# Altium schematic sheet CPU.SchDoc
size A3; DocumentNumber: 11; SheetNumber: 11; SheetTotal: 30
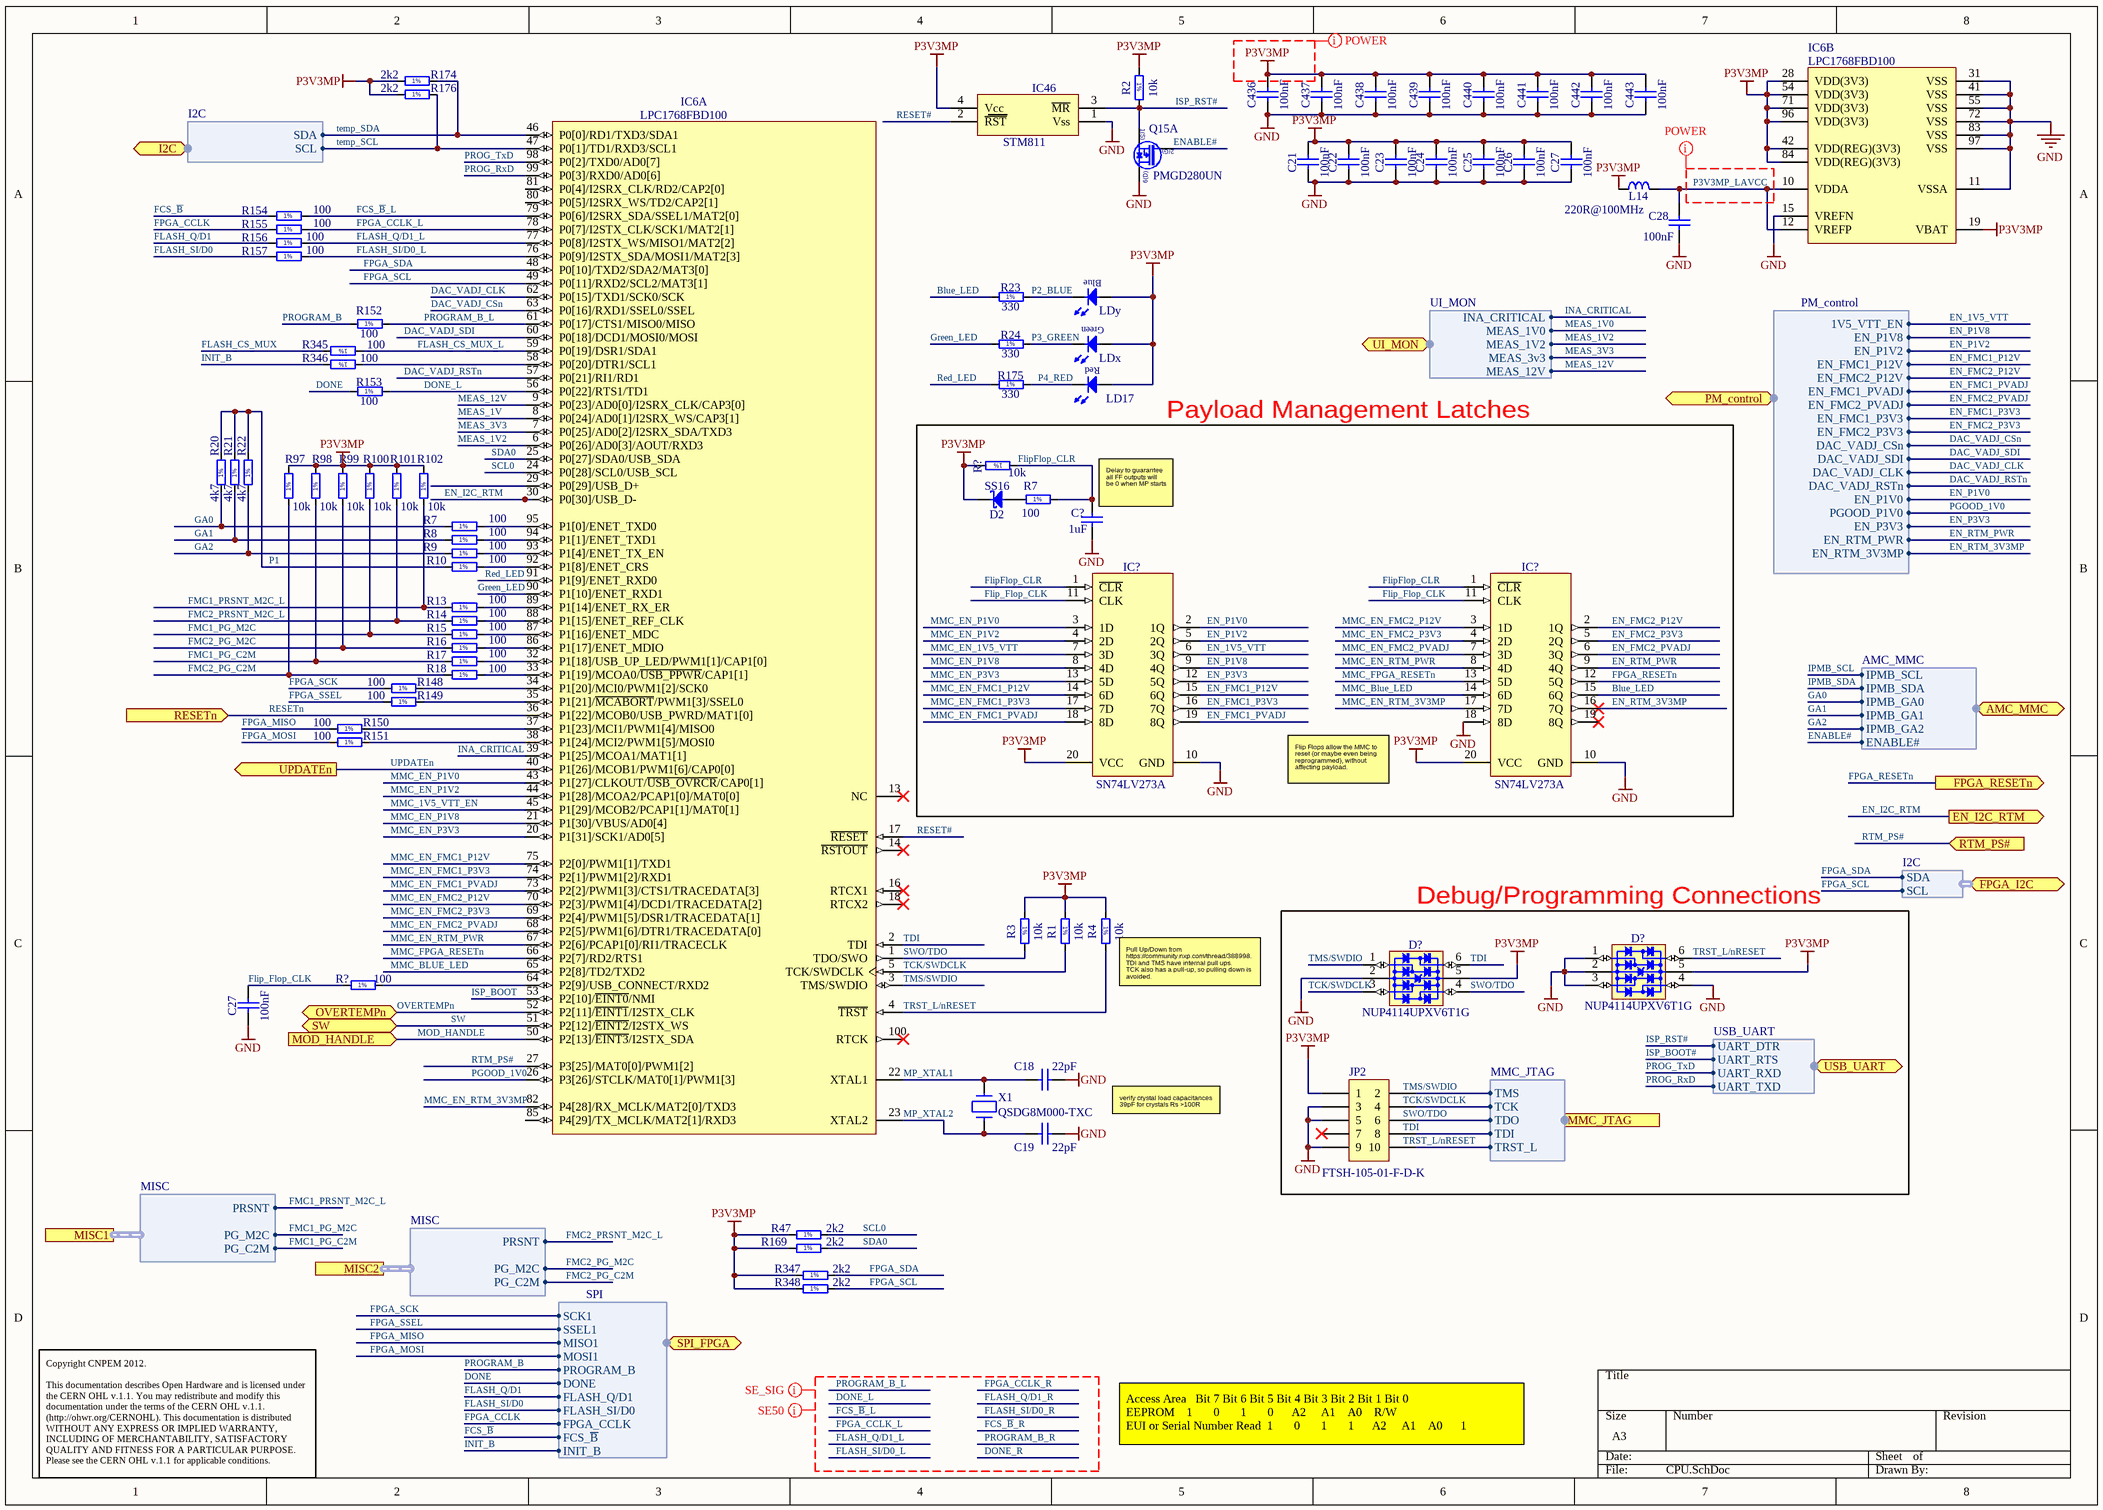
[diagram p0: CPU.SchDoc]

## Parts
(Parts that share a designator on the sheet are numbered #1, #2 ... from top to bottom, then left to right.)
C18  22pF  [CAPC1005X55N]
C19  22pF  [CAPC1005X55N]
C21  100nF  [CAPC0603X33N]
C22  100nF  [CAPC0603X33N]
C23  100nF  [CAPC0603X33N]
C24  100nF  [CAPC0603X33N]
C25  100nF  [CAPC0603X33N]
C26  100nF  [CAPC0603X33N]
C27#1  100nF  [CAPC0603X33N]
C27#2  100nF  [CAPC0603X33N]
C28  100nF  [CAPC0603X33N]
C436  100nF  [CAPC0603X33N]
C437  100nF  [CAPC0603X33N]
C438  100nF  [CAPC0603X33N]
C439  100nF  [CAPC0603X33N]
C440  100nF  [CAPC0603X33N]
C441  100nF  [CAPC0603X33N]
C442  100nF  [CAPC0603X33N]
C443  100nF  [CAPC0603X33N]
C?  1uF  [CAPC1608X87N]
D2  SS16  [DIOM5127X229N]
D?#1  NUP4114UPXV6T1G  [SOTFL50P160X60-6N]
D?#2  NUP4114UPXV6T1G  [SOTFL50P160X60-6N]
IC6  LPC1768FBD100  [QFP50P1600X1600X160-100N]  (parts A,B of 2)
IC46  STM811
IC?#1  SN74LV273A  [SOIC127P600X175-16N]
IC?#2  SN74LV273A  [SOIC127P600X175-16N]
JP2  FTSH-105-01-F-D-K  [CON_2x5_MINI]
L14  220R@100MHz  [INDC2012X105N]
LD17  Red  [LED_AVAGO_HSMC-C150]  (value not drawn)
LDx  Green  [LED_AVAGO_HSME-C120rev]  (value not drawn)
LDy  Blue  [LED_AVAGO_HSME-C120rev]  (value not drawn)
Q15  PMGD280UN  [SOT65P210X110-6N]  (part A of 2)
R1  10k  [RESC1005X40N]
R2  10k  [RESC1005X40N]
R3  10k  [RESC1005X40N]
R4  10k  [RESC1005X40N]
R7#1  100  [RESC1005X40N]
R7#2  100  [RESC1005X40N]
R8  100  [RESC1005X40N]
R9  100  [RESC1005X40N]
R10  100  [RESC1005X40N]
R13  100  [RESC1005X40N]
R14  100  [RESC1005X40N]
R15  100  [RESC1005X40N]
R16  100  [RESC1005X40N]
R17  100  [RESC1005X40N]
R18  100  [RESC1005X40N]
R20  4k7  [RESC1005X40N]
R21  4k7  [RESC1005X40N]
R22  4k7  [RESC1005X40N]
R23  330  [RESC1005X40N]
R24  330  [RESC1005X40N]
R47  2k2  [RESC1005X40N]
R97  10k  [RESC1005X40N]
R98  10k  [RESC1005X40N]
R99  10k  [RESC1005X40N]
R100  10k  [RESC1005X40N]
R101  10k  [RESC1005X40N]
R102  10k  [RESC1005X40N]
R148  100  [RESC1005X40N]
R149  100  [RESC1005X40N]
R150  100  [RESC1005X40N]
R151  100  [RESC1005X40N]
R152  100  [RESC1005X40N]
R153  100  [RESC1005X40N]
R154  100  [RESC1005X40N]
R155  100  [RESC1005X40N]
R156  100  [RESC1005X40N]
R157  100  [RESC1005X40N]
R169  2k2  [RESC1005X40N]
R174  2k2  [RESC1005X40N]
R175  330  [RESC1005X40N]
R176  2k2  [RESC1005X40N]
R345  100  [RESC1005X40N]
R346  100  [RESC1005X40N]
R347  2k2  [RESC1005X40N]
R348  2k2  [RESC1005X40N]
R?#1  10k  [RESC1005X40N]
R?#2  100  [RESC1005X40N]
X1  QSDG8M000-TXC  [XTAL_5.0*3.2]

## Blocks framed on the sheet
Payload Management Latches: C? D2 IC?#1 IC?#2 R7#1 R?#1
Debug/Programming Connections: D?#1 D?#2 JP2

## Ports
AMC_MMC (harness AMC_MMC), EN_I2C_RTM (out), FPGA_I2C (harness I2C), FPGA_RESETn (out), I2C (harness I2C), MISC1 (harness MISC), MISC2 (harness MISC), MMC_JTAG (harness MMC_JTAG), MOD_HANDLE (in), OVERTEMPn (bidir), PM_control (harness PM_control), RESETn (in), RTM_PS# (in), SPI_FPGA (harness SPI), SW, UI_MON (harness UI_MON), UPDATEn (out), USB_UART (harness USB_UART)

## Harnesses
SPI: SCK1, SSEL1, MISO1, MOSI1, FLASH_Q/D1, FLASH_SI/D0, PROGRAM_B, DONE, FPGA_CCLK, FCS_~{B}, INIT_B
MISC: PRSNT, PG_M2C, PG_C2M
I2C: SCL, SDA
MMC_JTAG: TCK, TDI, TDO, TMS, TRST_L
AMC_MMC: IPMB_SCL, IPMB_SDA, IPMB_GA0, IPMB_GA1, IPMB_GA2, ENABLE#
USB_UART: UART_DTR, UART_RTS, UART_RXD, UART_TXD
UI_MON: INA_CRITICAL, MEAS_1V0, MEAS_12V, MEAS_1V2, MEAS_3v3
PM_control: EN_P1V8, EN_P1V2, EN_FMC1_P12V, EN_FMC2_P12V, EN_FMC1_PVADJ, EN_FMC2_PVADJ, EN_FMC1_P3V3, EN_FMC2_P3V3, DAC_VADJ_CSn, DAC_VADJ_SDI, DAC_VADJ_CLK, DAC_VADJ_RSTn, 1V5_VTT_EN, EN_P1V0, PGOOD_P1V0, EN_P3V3, EN_RTM_PWR, EN_RTM_3V3MP

## Nets
GND: C18.1 C19.1 C21.1 C22.1 C23.1 C24.1 C25.1 C26.1 C27#1.1 C27#2.1 C28.1 C436.1 C437.1 C438.1 C439.1 C440.1 C441.1 C442.1 C443.1 C?.2 D?#1.1(I/O1) D?#1.2(GND) D?#1.3(I/O2) D?#1.4(I/O3) D?#2.2(GND) IC6.11(VSSA) IC6.15(VREFN) IC6.31(VSS) IC6.41(VSS) IC6.55(VSS) IC6.72(VSS) IC6.83(VSS) IC6.97(VSS) IC46.1(Vss) IC?#1.10(GND) IC?#2.10(GND) IC?#2.18(8D) JP2.3 JP2.5 JP2.9 Q15.6(D)
P3V3MP: C21.2 C22.2 C23.2 C24.2 C25.2 C26.2 C27#1.2 C436.2 C437.2 C438.2 C439.2 C440.2 C441.2 C442.2 C443.2 D2.1(C) D?#1.5(VBUS) D?#2.5(VBUS) IC6.19(VBAT) IC6.28(VDD(3V3)) IC6.42(VDD(REG)(3V3)) IC6.54(VDD(3V3)) IC6.71(VDD(3V3)) IC6.84(VDD(REG)(3V3)) IC6.96(VDD(3V3)) IC46.4(Vcc) IC?#1.20(VCC) IC?#2.20(VCC) JP2.1 L14.1 LD17.2(A) LDx.1(A) LDy.1(A) R1.1 R2.1 R3.1 R4.1 R47.1 R97.2 R98.2 R99.2 R100.2 R101.2 R102.2 R169.1 R174.1 R176.1 R347.1 R348.1 R?#1.2
Blue_LED: IC?#2.15(6Q) R23.1
DAC_VADJ_CLK: IC6.62(P0[15]/TXD1/SCK0/SCK) ; port PM_control.DAC_VADJ_CLK
DAC_VADJ_CSn: IC6.63(P0[16]/RXD1/SSEL0/SSEL) ; port PM_control.DAC_VADJ_CSn
DAC_VADJ_RSTn: IC6.57(P0[21]/RI1/RD1) ; port PM_control.DAC_VADJ_RSTn
DAC_VADJ_SDI: IC6.60(P0[18]/DCD1/MOSI0/MOSI) ; port PM_control.DAC_VADJ_SDI
DONE: R153.2 ; port SPI_FPGA.DONE
DONE_L: IC6.56(P0[22]/RTS1/TD1) R153.1
EN_1V5_VTT: IC?#1.6(3Q) ; port PM_control.1V5_VTT_EN
EN_FMC1_P3V3: IC?#1.16(7Q) ; port PM_control.EN_FMC1_P3V3
EN_FMC1_P12V: IC?#1.15(6Q) ; port PM_control.EN_FMC1_P12V
EN_FMC1_PVADJ: IC?#1.19(8Q) ; port PM_control.EN_FMC1_PVADJ
EN_FMC2_P3V3: IC?#2.5(2Q) ; port PM_control.EN_FMC2_P3V3
EN_FMC2_P12V: IC?#2.2(1Q) ; port PM_control.EN_FMC2_P12V
EN_FMC2_PVADJ: IC?#2.6(3Q) ; port PM_control.EN_FMC2_PVADJ
EN_I2C_RTM: IC6.30(P0[30]/USB_D-) ; port EN_I2C_RTM
EN_P1V0: IC?#1.2(1Q) ; port PM_control.EN_P1V0
EN_P1V2: IC?#1.5(2Q) ; port PM_control.EN_P1V2
EN_P1V8: IC?#1.9(4Q) ; port PM_control.EN_P1V8
EN_P3V3: IC?#1.12(5Q) ; port PM_control.EN_P3V3
EN_RTM_3V3MP: IC?#2.16(7Q) ; port PM_control.EN_RTM_3V3MP
EN_RTM_PWR: IC?#2.9(4Q) ; port PM_control.EN_RTM_PWR
ENABLE#: Q15.2(G) ; port AMC_MMC.ENABLE#
FCS_~{B}: R154.1 ; port SPI_FPGA.FCS_~{B}
FCS_~{B}_L: IC6.79(P0[6]/I2SRX_SDA/SSEL1/MAT2[0]) R154.2
FLASH_CS_MUX: R345.1
FLASH_CS_MUX_L: IC6.59(P0[19]/DSR1/SDA1) R345.2
FLASH_Q/D1: R156.1 ; port SPI_FPGA.FLASH_Q/D1
FLASH_Q/D1_L: IC6.77(P0[8]/I2STX_WS/MISO1/MAT2[2]) R156.2
FLASH_SI/D0: R157.1 ; port SPI_FPGA.FLASH_SI/D0
FLASH_SI/D0_L: IC6.76(P0[9]/I2STX_SDA/MOSI1/MAT2[3]) R157.2
Flip_Flop_CLK: C27#2.2 IC?#1.11(CLK) IC?#2.11(CLK) R?#2.2
FlipFlop_CLR: C?.1 IC?#1.1(~{CLR}) IC?#2.1(~{CLR}) R7#1.2 R?#1.1
FMC1_PG_C2M: R17.1 R98.1 ; port MISC1.PG_C2M
FMC1_PG_M2C: R15.1 R100.1 ; port MISC1.PG_M2C
FMC1_PRSNT_M2C_L: R13.1 R102.1 ; port MISC1.PRSNT
FMC2_PG_C2M: R18.1 R97.1 ; port MISC2.PG_C2M
FMC2_PG_M2C: R16.1 R99.1 ; port MISC2.PG_M2C
FMC2_PRSNT_M2C_L: R14.1 R101.1 ; port MISC2.PRSNT
FPGA_CCLK: R155.1 ; port SPI_FPGA.FPGA_CCLK
FPGA_CCLK_L: IC6.78(P0[7]/I2STX_CLK/SCK1/MAT2[1]) R155.2
FPGA_MISO: R150.2 ; port SPI_FPGA.MISO1
FPGA_MOSI: R151.2 ; port SPI_FPGA.MOSI1
FPGA_RESETn: IC?#2.12(5Q) ; port FPGA_RESETn
FPGA_SCK: R148.2 ; port SPI_FPGA.SCK1
FPGA_SCL: IC6.49(P0[11]/RXD2/SCL2/MAT3[1]) R348.2 ; port FPGA_I2C.SCL
FPGA_SDA: IC6.48(P0[10]/TXD2/SDA2/MAT3[0]) R347.2 ; port FPGA_I2C.SDA
FPGA_SSEL: R149.2 ; port SPI_FPGA.SSEL1
GA0: R7#2.1 R20.1 ; port AMC_MMC.IPMB_GA0
GA1: R8.1 R21.1 ; port AMC_MMC.IPMB_GA1
GA2: R9.1 R22.1 ; port AMC_MMC.IPMB_GA2
Green_LED: IC6.90(P1[10]/ENET_RXD1) R24.1
INA_CRITICAL: IC6.39(P1[25]/MCOA1/MAT1[1]) ; port UI_MON.INA_CRITICAL
INIT_B: R346.1 ; port SPI_FPGA.INIT_B
IPMB_SCL: port AMC_MMC.IPMB_SCL
IPMB_SDA: port AMC_MMC.IPMB_SDA
ISP_BOOT: IC6.53(P2[10]/~{EINT0}/NMI)
ISP_BOOT#: port USB_UART.UART_RTS
ISP_RST#: IC46.3(~{MR}) Q15.1(S) R2.2 ; port USB_UART.UART_DTR
MEAS_1V: IC6.8(P0[24]/AD0[1]/I2SRX_WS/CAP3[1])
MEAS_1V0: port UI_MON.MEAS_1V0
MEAS_1V2: IC6.6(P0[26]/AD0[3]/AOUT/RXD3) ; port UI_MON.MEAS_1V2
MEAS_3V3: IC6.7(P0[25]/AD0[2]/I2SRX_SDA/TXD3) ; port UI_MON.MEAS_3v3
MEAS_12V: IC6.9(P0[23]/AD0[0]/I2SRX_CLK/CAP3[0]) ; port UI_MON.MEAS_12V
MMC_1V5_VTT_EN: IC6.45(P1[29]/MCOB2/PCAP1[1]/MAT0[1])
MMC_BLUE_LED: IC6.65(P2[8]/TD2/TXD2) IC?#2.14(6D)
MMC_EN_1V5_VTT: IC?#1.7(3D)
MMC_EN_FMC1_P3V3: IC6.74(P2[1]/PWM1[2]/RXD1) IC?#1.17(7D)
MMC_EN_FMC1_P12V: IC6.75(P2[0]/PWM1[1]/TXD1) IC?#1.14(6D)
MMC_EN_FMC1_PVADJ: IC6.73(P2[2]/PWM1[3]/CTS1/TRACEDATA[3]) IC?#1.18(8D)
MMC_EN_FMC2_P3V3: IC6.69(P2[4]/PWM1[5]/DSR1/TRACEDATA[1]) IC?#2.4(2D)
MMC_EN_FMC2_P12V: IC6.70(P2[3]/PWM1[4]/DCD1/TRACEDATA[2]) IC?#2.3(1D)
MMC_EN_FMC2_PVADJ: IC6.68(P2[5]/PWM1[6]/DTR1/TRACEDATA[0]) IC?#2.7(3D)
MMC_EN_P1V0: IC6.43(P1[27]/CLKOUT/~{USB_OVRCR}/CAP0[1]) IC?#1.3(1D)
MMC_EN_P1V2: IC6.44(P1[28]/MCOA2/PCAP1[0]/MAT0[0]) IC?#1.4(2D)
MMC_EN_P1V8: IC6.21(P1[30]/VBUS/AD0[4]) IC?#1.8(4D)
MMC_EN_P3V3: IC6.20(P1[31]/SCK1/AD0[5]) IC?#1.13(5D)
MMC_EN_RTM_3V3MP: IC6.82(P4[28]/RX_MCLK/MAT2[0]/TXD3) IC?#2.17(7D)
MMC_EN_RTM_PWR: IC6.67(P2[6]/PCAP1[0]/RI1/TRACECLK) IC?#2.8(4D)
MMC_FPGA_RESETn: IC6.66(P2[7]/RD2/RTS1) IC?#2.13(5D)
MOD_HANDLE: IC6.50(P2[13]/~{EINT3}/I2STX_SDA) ; port MOD_HANDLE
MP_XTAL1: C18.2 IC6.22(XTAL1) X1.1
MP_XTAL2: C19.2 IC6.23(XTAL2) X1.2
OVERTEMPn: IC6.52(P2[11]/~{EINT1}/I2STX_CLK) ; port OVERTEMPn
P1: R10.1 R20.2 R21.2 R22.2
P2_BLUE: LDy.2(C) R23.2
P3_GREEN: LDx.2(C) R24.2
P3V3MP_LAVCC: C28.2 IC6.10(VDDA) IC6.12(VREFP) L14.2
P4_RED: LD17.1(C) R175.2
PGOOD_1V0: IC6.26(P3[26]/STCLK/MAT0[1]/PWM1[3]) ; port PM_control.PGOOD_P1V0
PROG_RxD: IC6.99(P0[3]/RXD0/AD0[6]) ; port USB_UART.UART_TXD
PROG_TxD: IC6.98(P0[2]/TXD0/AD0[7]) ; port USB_UART.UART_RXD
PROGRAM_B: R152.2 ; port SPI_FPGA.PROGRAM_B
PROGRAM_B_L: IC6.61(P0[17]/CTS1/MISO0/MISO) R152.1
Red_LED: IC6.91(P1[9]/ENET_RXD0) R175.1
RESET#: IC6.17(~{RESET}) IC46.2(~{RST})
RESETn: IC6.36(P1[22]/MCOB0/USB_PWRD/MAT1[0]) ; port RESETn
RTM_PS#: IC6.27(P3[25]/MAT0[0]/PWM1[2]) ; port RTM_PS#
SCL0: IC6.24(P0[28]/SCL0/USB_SCL) R47.2
SDA0: IC6.25(P0[27]/SDA0/USB_SDA) R169.2
SW: IC6.51(P2[12]/~{EINT2}/I2STX_WS) ; port SW
SWO/TDO: D?#2.4(I/O3) IC6.1(TDO/SWO) R3.2
TCK/SWDCLK: D?#2.3(I/O2) IC6.5(TCK/SWDCLK) R1.2
TDI: D?#2.6(I/O4) IC6.2(TDI)
temp_SCL: IC6.47(P0[1]/TD1/RXD3/SCL1) R176.2 ; port I2C.SCL
temp_SDA: IC6.46(P0[0]/RD1/TXD3/SDA1) R174.2 ; port I2C.SDA
TMS/SWDIO: D?#2.1(I/O1) IC6.3(TMS/SWDIO)
TRST_L/nRESET: D?#1.6(I/O4) IC6.4(~{TRST}) R4.2
UPDATEn: IC6.40(P1[26]/MCOB1/PWM1[6]/CAP0[0]) ; port UPDATEn
NetD2_2: D2.2(A) R7#1.1
NetIC6_32: IC6.32(P1[18]/USB_UP_LED/PWM1[1]/CAP1[0]) R17.2
NetIC6_33: IC6.33(P1[19]/MCOA0/~{USB_PPWR}/CAP1[1]) R18.2
NetIC6_34: IC6.34(P1[20]/MCI0/PWM1[2]/SCK0) R148.1
NetIC6_35: IC6.35(P1[21]/~{MCABORT}/PWM1[3]/SSEL0) R149.1
NetIC6_37: IC6.37(P1[23]/MCI1/PWM1[4]/MISO0) R150.1
NetIC6_38: IC6.38(P1[24]/MCI2/PWM1[5]/MOSI0) R151.1
NetIC6_58: IC6.58(P0[20]/DTR1/SCL1) R346.2
NetIC6_64: IC6.64(P2[9]/USB_CONNECT/RXD2) R?#2.1
NetIC6_86: IC6.86(P1[17]/ENET_MDIO) R16.2
NetIC6_87: IC6.87(P1[16]/ENET_MDC) R15.2
NetIC6_88: IC6.88(P1[15]/ENET_REF_CLK) R14.2
NetIC6_89: IC6.89(P1[14]/ENET_RX_ER) R13.2
NetIC6_92: IC6.92(P1[8]/ENET_CRS) R10.2
NetIC6_93: IC6.93(P1[4]/ENET_TX_EN) R9.2
NetIC6_94: IC6.94(P1[1]/ENET_TXD1) R8.2
NetIC6_95: IC6.95(P1[0]/ENET_TXD0) R7#2.2
NetJP2_2: JP2.2 ; port MMC_JTAG.TMS
NetJP2_4: JP2.4 ; port MMC_JTAG.TCK
NetJP2_6: JP2.6 ; port MMC_JTAG.TDO
NetJP2_8: JP2.8 ; port MMC_JTAG.TDI
NetJP2_10: JP2.10 ; port MMC_JTAG.TRST_L

Not connected (* = marked no-connect by the designer): IC6 13(NC)* 14(~{RSTOUT})* 16(RTCX1)* 18(RTCX2)* 29(P0[29]/USB_D+) 80(P0[5]/I2SRX_WS/TD2/CAP2[1]) 81(P0[4]/I2SRX_CLK/RD2/CAP2[0]) 85(P4[29]/TX_MCLK/MAT2[1]/RXD3) 100(RTCK)*; IC?#2 19(8Q)*; JP2 7*

## Layout directives
net class SE_SIG: DONE_L, DONE_R, FCS_~{B}_L, FCS_~{B}_R, FLASH_Q/D1_L, FLASH_Q/D1_R, FLASH_SI/D0_L, FLASH_SI/D0_R, FPGA_CCLK_L, FPGA_CCLK_R, PROGRAM_B_L, PROGRAM_B_R
net class SE50: DONE_L, DONE_R, FCS_~{B}_L, FCS_~{B}_R, FLASH_Q/D1_L, FLASH_Q/D1_R, FLASH_SI/D0_L, FLASH_SI/D0_R, FPGA_CCLK_L, FPGA_CCLK_R, PROGRAM_B_L, PROGRAM_B_R
net class POWER: P3V3MP, P3V3MP_LAVCC

## Notes on the sheet
- (near C?) Delay to guarantee all FF outputs will be 0 when MP starts
- Flip Flops allow the MMC to reset (or maybe even being reprogrammed), without affecting payload.
- (near R4) Pull Up/Down from https://community.nxp.com/thread/388998.
  TDI and TMS have internal pull ups.
  TCK also has a pull-up, so pulling down is avoided.
- verify crystal load capacitances
  39pF for crystals Rs >100R
- Access Area 		Bit 7 Bit 6 Bit 5 Bit 4 Bit 3 Bit 2 Bit 1 Bit 0
  EEPROM 			1       0       1       0      A2     A1    A0    R/W
  EUI or Serial Number Read 	1       0       1       1      A2     A1    A0      1
- Copyright CNPEM 2012.
  This documentation describes Open Hardware and is licensed under the CERN OHL v.1.1. You may redistribute and modify this documentation under the terms of the CERN OHL v.1.1. (http://ohwr.org/CERNOHL). This documentation is distributed WITHOUT ANY EXPRESS OR IMPLIED WARRANTY, INCLUDING OF MERCHANTABILITY, SATISFACTORY QUALITY AND FITNESS FOR A PARTICULAR PURPOSE. Please see the CERN OHL v.1.1 for applicable conditions.
- Labels drawn without touching a wire or pin: SWO/TDO, TCK/SWDCLK, TDI, TMS/SWDIO, TRST_L/nRESET
- (in symbol PMGD280UN, part A) 1(S); 2(G); 6(D)
- (in symbol R0402_2K2_1%_0.0625W_100PPM) 1%
- (in symbol R0402_4K7_1%_0.0625W_100PPM) 1%
- (in symbol R0402_10K_1%_0.0625W_100PPM) 1%
- (in symbol R0402_100R_1%_0.0625W_100PPM) 1%
- (in symbol R0402_330R_1%_0.0625W_100PPM) 1%

## Library data of the parts
C18 C19 = CC0402_22PF_50V_5%_NP0: Non-polarised capacitor; Part Description: SMD Multilayer Chip Ceramic Capacitor; Manufacturer: GENERIC; Manufacturer1 Part Number: 223886915229; Voltage: 50V; TC: NP0; Tolerance: ±5%; Table: Capacitors SMD; Part Number: CC0402_22PF_50V_5%_NP0; Component Kind: Standard; Component Type: Standard; Pin Count: 2; Value: 22pF; Status: Not Recommended; Manufacturer Part Number: CC0402_22PF_50V_5%_NP0; Case: 0402; Mounted: Yes; Socket: No; SMD: Yes; Manufacturer1 Example: PHYCOMP; Manufacturer1 ComponentHeight: 0.55mm; HelpURL: \\cern.ch\dfs\Applications\Altium\Datasheets\CC0402_NP0_PHYCOMP.pdf; Author: CERN DEM JLC; CreateDate: 2007-12-03; LatestRevisionDate: 2007-12-03
C21-C26 C27#1 C27#2 C28 C436-C443 = CC0201_100NF_6.3V_10%_X5R: Non-polarised capacitor; Part Description: SMD Multilayer Chip Ceramic Capacitor; Manufacturer: GENERIC; Manufacturer1 Part Number: 02016D104KAT2A; Voltage: 6.3V; TC: X5R; Tolerance: ±10%; Table: Capacitors SMD; Part Number: CC0201_100NF_6.3V_10%_X5R; Component Kind: Standard; Component Type: Standard; Pin Count: 2; Value: 100nF; Status: Not Recommended; Manufacturer Part Number: CC0201_100NF_6.3V_10%_X5R; Case: 0201; Mounted: Yes; Socket: No; SMD: Yes; Manufacturer1 Example: AVX; Manufacturer1 ComponentHeight: 0.33mm; HelpURL: \\cern.ch\dfs\Applications\Altium\Datasheets\CC0201_X5R_AVX.pdf; Author: CERN DEM JLC; CreateDate: 2007-12-03; LatestRevisionDate: 2007-12-03
C? = CC0603_1UF_16V_10%_X7R: Non-polarised capacitor; Part Description: SMD Multilayer Chip Ceramic Capacitor; Manufacturer: GENERIC; Manufacturer1 Part Number: 223824613663; Voltage: 16V; TC: X7R; Tolerance: ±10%; Table: Capacitors SMD; Part Number: CC0603_1UF_16V_10%_X7R; Component Kind: Standard; Component Type: Standard; Pin Count: 2; Value: 1uF; Status: Preferred; Manufacturer Part Number: CC0603_1uF_16V_10%_X7R; Case: 0603; Mounted: Yes; Socket: No; SMD: Yes; Manufacturer1 Example: PHYCOMP; Manufacturer1 ComponentHeight: 0.87mm; HelpURL: \\cern.ch\dfs\Applications\Altium\Datasheets\CC0805_X5R_PHYCOMP_HC.pdf; Author: CERN DEM JLC; CreateDate: 2007-12-03; LatestRevisionDate: 2007-12-03
D2 = SS16: Schottky Diode; Part Description: Surface Mount Schottky Barrier Rectifier; Manufacturer: VISHAY GENERAL SEMICONDUCTOR; Voltage: 60V; Power: 1A; Table: Diodes; Part Number: SS16; Component Kind: Standard; Component Type: Standard; Device: SS16; PackageDescription: DO-214-AC Molded Diode, Body 5.1x2.7mm, IPC Medium Density; Manufacturer Part Number: SS16; Pin Count: 2; Case: DO-214AC; Mounted: Yes; Socket: No; SMD: Yes; ComponentHeight: 2.29mm; HelpURL: \\cern.ch\dfs\Applications\Altium\Datasheets\SS16.pdf; Author: CERN DEM JLC; CreateDate: 2008-07-15; LatestRevisionDate: 2010-08-23
D?#1 D?#2 = NUP4114UPXV6T1G: Part Description: ESD Protection Diodes Array (8kV) with Low Clamping Voltage; Manufacturer: ON SEMICONDUCTOR; Voltage: 5.5V; PressFit: No; Bonding: No; Part Number: NUP4114UPXV6T1G; Component Kind: Standard; Component Type: Standard; Device: NUP4114UPXV6T1G; PackageDescription: SOTFL (SOT666, SOT563,), 0.50mm, Pitch; 6 Pin, 1.20mm W X 1.60mm L X 0.60mm H Body, IPC Medium Density; Manufacturer Part Number: NUP4114UPXV6T1G; Pin Count: 8; Mounted: Yes; Socket: No; SMD: Yes; Sense: No; ComponentHeight: 1.75mm; HelpURL: \\cern.ch\dfs\Applications\Altium\Datasheets\NUP4114UPXV6T1G.pdf; Author: CERN DEM JLC; CreateDate: 05/12/2012; LatestRevisionDate: 05/12/2012
IC6 = LPC1768FBD100: LPC1768 Series 64kB 100MHz 32-Bit ARM Cortex-M3 Microcontroller; Part Description: 32-bit 100MHz ARM Cortex-M3 Microcontroller, 512kB Flash, 64kB SRAM, with Ethernet, USB 2.0 Host/Device/OTG, CAN; Manufacturer: NXP SEMICONDUCTORS; PressFit: No; Bonding: No; Part Number: LPC1768FBD100; Component Kind: Standard; Component Type: Standard; Device: LPC1768FBD100; PackageDescription: QFP, 0.50mm Pitch, Square; 100 Pin,14.00mm L X 14.00mm W X 1.60mm H Body, IPC Medium Density; Manufacturer Part Number: LPC1768FBD100; Pin Count: 100; Case: QFP100; Mounted: Yes; Socket: No; SMD: Yes; Sense: No; ComponentHeight: 1.6mm; HelpURL: \\cern.ch\dfs\Applications\Altium\Datasheets\LPC1768FBD100.pdf; Author: CERN DEM JLC; CreateDate: 06/10/2016; LatestRevisionDate: 06/10/2016
IC46 = STM811: Triple-Channel, High-Side Measurement, Shunt and Bus Voltage Monitor  with I  2C™ Interface
IC?#1 IC?#2 = SN74LV273A: Octal D-Type Flip-Flops With Clear
JP2 = CON_HEADER 5X2: PBTD10S
L14 = IND0805_MURATA_BLM21PG221SN1D: Inductor; Part Description: SMD EMIFIL Suppression Chip Ferrite Bead; Manufacturer: MURATA; Power: 2A; Resistance: 0.05R; Tolerance: ±25%; Table: Inductors SMD; Part Number: IND0805_MURATA_BLM21PG221SN1D; Component Kind: Standard; Component Type: Standard; Pin Count: 2; Value: 220R@100MHz; Status: None; Manufacturer Part Number: BLM21PG221SN1D; Case: 0805; Mounted: Yes; Socket: No; SMD: Yes; ComponentHeight: 1.05mm; HelpURL: \\cern.ch\dfs\Applications\Altium\Datasheets\IND0402_MURATA_BLM21P.pdf; Author: CERN DEM JLC; CreateDate: 2010-01-25; LatestRevisionDate: 2010-01-25
LD17 = LED_AVAGO_HSMC-C150: LED Red 1C 2A; Part Description: Surface Mount Red LED (1206 Case); Manufacturer: AVAGO TECHNOLOGIES; PressFit: No; Bonding: No; Part Number: LED_AVAGO_HSMC-C150; Component Kind: Standard; Component Type: Standard; Color: Red; PackageDescription: Red Chip LED, 2-Leads, Body 3.2 x1.6mm, IPC Medium Density; Manufacturer Part Number: HSMC-C150; Pin Count: 2; Case: 1206; Mounted: Yes; Socket: No; SMD: Yes; Sense: No; ComponentHeight: 1.2mm; HelpURL: \\cern.ch\dfs\Applications\Altium\Datasheets\LED_AVAGO_HSMC-C150.pdf; Author: CERN DEM JLC; CreateDate: 18/06/2013; LatestRevisionDate: 18/06/2013
LDx = LED_SMD_90deg_mini_G: LED Green Avago C120; Part Number: LED_AVAGO_HSME-C120; Part Description: High Performance Right Angle Chip Green LED; Manufacturer: AVAGO TECHNOLOGIES; Manufacturer Part Number: HSME-C120; Table: LEDs & Displays; Component Kind: Standard; Component Type: Standard; Color: Green; Footprint: LED_AVAGO_HSME-C120; PackageDescription: Green Chip LED, 2-Leads, Body 1.7x1.1mm, Side Emitting Package; Pin Count: 2; Mounted: Yes; Socket: No; SMD: Yes; ComponentHeight: 0.7mm; HelpURL: \\cern.ch\dfs\Applications\Altium\Datasheets\LED_AVAGO_HSME-C120.pdf; ComponentLink1URL: \\cern.ch\dfs\Applications\Altium\Datasheets\LED_AVAGO_HSME-C110_DESIGN-GUIDE.pdf; ComponentLink1Description: Design Guide; Author: CERN DEM JMW; CreateDate: 2009-07-22; LatestRevisionDate: 2012-06-20
LDy = LED_SMD_90deg_mini_B: LED Blue Avago C120; Part Number: LED_AVAGO_HSMR-C120; Part Description: High Performance Right Angle Chip Blue LED; Manufacturer: AVAGO TECHNOLOGIES; Manufacturer Part Number: HSMR-C120; Table: LEDs & Displays; Component Kind: Standard; Component Type: Standard; Color: Blue; Footprint: LED_AVAGO_HSMR-C120; PackageDescription: Blue Chip LED, 2-Leads, Body 1.7x1.1mm, Side Emitting Package; Pin Count: 2; Mounted: Yes; Socket: No; SMD: Yes; ComponentHeight: 0.7mm; HelpURL: \\cern.ch\dfs\Applications\Altium\Datasheets\LED_AVAGO_HSME-C120.pdf; ComponentLink1URL: \\cern.ch\dfs\Applications\Altium\Datasheets\LED_AVAGO_HSME-C110_DESIGN-GUIDE.pdf; ComponentLink1Description: Design Guide; Author: CERN DEM JMW; CreateDate: 2009-07-22; LatestRevisionDate: 2012-06-20
Q15 = PMGD280UN: Dual N-Channel micro TrenchMOS™ Ultra Low Level FET; Manufacturer: NXP SEMICONDUCTORS; Part Description: 20V 870mA Dual N-Channel micro TrenchMOS™ Ultra Low Level FET; Bonding: No; PressFit: No; Part Number: PMGD280UN; Author: CERN DEM JLC; Case: SOT363; ComponentHeight: 1.1mm; Component Type: Standard; CreateDate: 19/11/2014; Device: PMGD280UN; HelpURL: \\cern.ch\dfs\Applications\Altium\Datasheets\PMGD280UN.pdf; LatestRevisionDate: 19/11/2014; Manufacturer Part Number: PMGD280UN; Mounted: Yes; PackageDescription: SOT363, SC70-6, SOT, 0.65mm Pitch, 6 pin, 1.25mm W X 2.00mm L X 1.10mm H, IPC Medium Density; Pin Count: 6; Sense: No; SMD: Yes; Socket: No
R1-R4 R97-R102 R?#1 = R0402_10K_1%_0.0625W_100PPM: Resistor - 1%; Part Description: General Purpose Thick Film Chip Resistor; Manufacturer: GENERIC; Manufacturer1 Part Number: 232270671003L; TC: ±100ppm/°C; Table: Resistors SMD; Part Number: R0402_10K_1%_0.0625W_100PPM; Component Kind: Standard; Component Type: Standard; Pin Count: 2; Value: 10k; Status: Not recommended; Power: 0.0625W; Tolerance: ±1%; Manufacturer Part Number: R0402_10K_1%_0.0625W_100PPM; Case: 0402; Mounted: Yes; Socket: No; SMD: Yes; Manufacturer1 Example: YAGEO PHYCOMP; Manufacturer1 ComponentHeight: 0.4mm; HelpURL: \\cern.ch\dfs\Applications\Altium\Datasheets\R0402_Phycomp_RC0402.pdf; Author: CERN DEM JLC; CreateDate: 2007-12-03; LatestRevisionDate: 2012-10-17
R7#1 R7#2 R8-R10 R13-R18 R148-R157 R345 R346 R?#2 = R0402_100R_1%_0.0625W_100PPM: Resistor - 1%; Part Description: General Purpose Thick Film Chip Resistor; Manufacturer: GENERIC; Manufacturer1 Part Number: 232270671001L; TC: ±100ppm/°C; Table: Resistors SMD; Part Number: R0402_100R_1%_0.0625W_100PPM; Component Kind: Standard; Component Type: Standard; Pin Count: 2; Value: 100; Status: Not recommended; Power: 0.0625W; Tolerance: ±1%; Manufacturer Part Number: R0402_100R_1%_0.0625W_100PPM; Case: 0402; Mounted: Yes; Socket: No; SMD: Yes; Manufacturer1 Example: YAGEO PHYCOMP; Manufacturer1 ComponentHeight: 0.4mm; HelpURL: \\cern.ch\dfs\Applications\Altium\Datasheets\R0402_Phycomp_RC0402.pdf; Author: CERN DEM JLC; CreateDate: 2007-12-03; LatestRevisionDate: 2012-10-17
R20-R22 = R0402_4K7_1%_0.0625W_100PPM: Resistor - 1%; Part Description: General Purpose Thick Film Chip Resistor; Manufacturer: GENERIC; Manufacturer1 Part Number: 232270674702L; TC: ±100ppm/°C; Table: Resistors SMD; Part Number: R0402_4K7_1%_0.0625W_100PPM; Component Kind: Standard; Component Type: Standard; Pin Count: 2; Value: 4k7; Status: Not recommended; Power: 0.0625W; Tolerance: ±1%; Manufacturer Part Number: R0402_4K7_1%_0.0625W_100PPM; Case: 0402; Mounted: Yes; Socket: No; SMD: Yes; Manufacturer1 Example: YAGEO PHYCOMP; Manufacturer1 ComponentHeight: 0.4mm; HelpURL: \\cern.ch\dfs\Applications\Altium\Datasheets\R0402_Phycomp_RC0402.pdf; Author: CERN DEM JLC; CreateDate: 2007-12-03; LatestRevisionDate: 2012-10-17
R23 R24 R175 = R0402_330R_1%_0.0625W_100PPM: Resistor - 1%; Part Description: General Purpose Thick Film Chip Resistor; Manufacturer: GENERIC; Manufacturer1 Part Number: 232270673301L; TC: ±100ppm/°C; Table: Resistors SMD; Part Number: R0402_330R_1%_0.0625W_100PPM; Component Kind: Standard; Component Type: Standard; Pin Count: 2; Value: 330; Status: Not recommended; Power: 0.0625W; Tolerance: ±1%; Manufacturer Part Number: R0402_330R_1%_0.0625W_100PPM; Case: 0402; Mounted: Yes; Socket: No; SMD: Yes; Manufacturer1 Example: YAGEO PHYCOMP; Manufacturer1 ComponentHeight: 0.4mm; HelpURL: \\cern.ch\dfs\Applications\Altium\Datasheets\R0402_Phycomp_RC0402.pdf; Author: CERN DEM JLC; CreateDate: 2007-12-03; LatestRevisionDate: 2012-10-17
R47 R169 R174 R176 R347 R348 = R0402_2K2_1%_0.0625W_100PPM: Resistor - 1%; Part Description: General Purpose Thick Film Chip Resistor; Manufacturer: GENERIC; Manufacturer1 Part Number: 232270672202L; TC: ±100ppm/°C; Table: Resistors SMD; Part Number: R0402_2K2_1%_0.0625W_100PPM; Component Kind: Standard; Component Type: Standard; Pin Count: 2; Value: 2k2; Status: Not recommended; Power: 0.0625W; Tolerance: ±1%; Manufacturer Part Number: R0402_2K2_1%_0.0625W_100PPM; Case: 0402; Mounted: Yes; Socket: No; SMD: Yes; Manufacturer1 Example: YAGEO PHYCOMP; Manufacturer1 ComponentHeight: 0.4mm; HelpURL: \\cern.ch\dfs\Applications\Altium\Datasheets\R0402_Phycomp_RC0402.pdf; Author: CERN DEM JLC; CreateDate: 2007-12-03; LatestRevisionDate: 2012-10-17
X1 = X_CRYSTAL_SMD_5.0*3.2: miniature crystal oscillator (Maritex) QSDG8M000-TXC